# Altium schematic sheet Jukebox Processing.SchDoc: Jukebox CPU and CPLD
size B; DrawnBy: Tim Menninger; Revision: 2.0; SheetNumber: 2; SheetTotal: 5
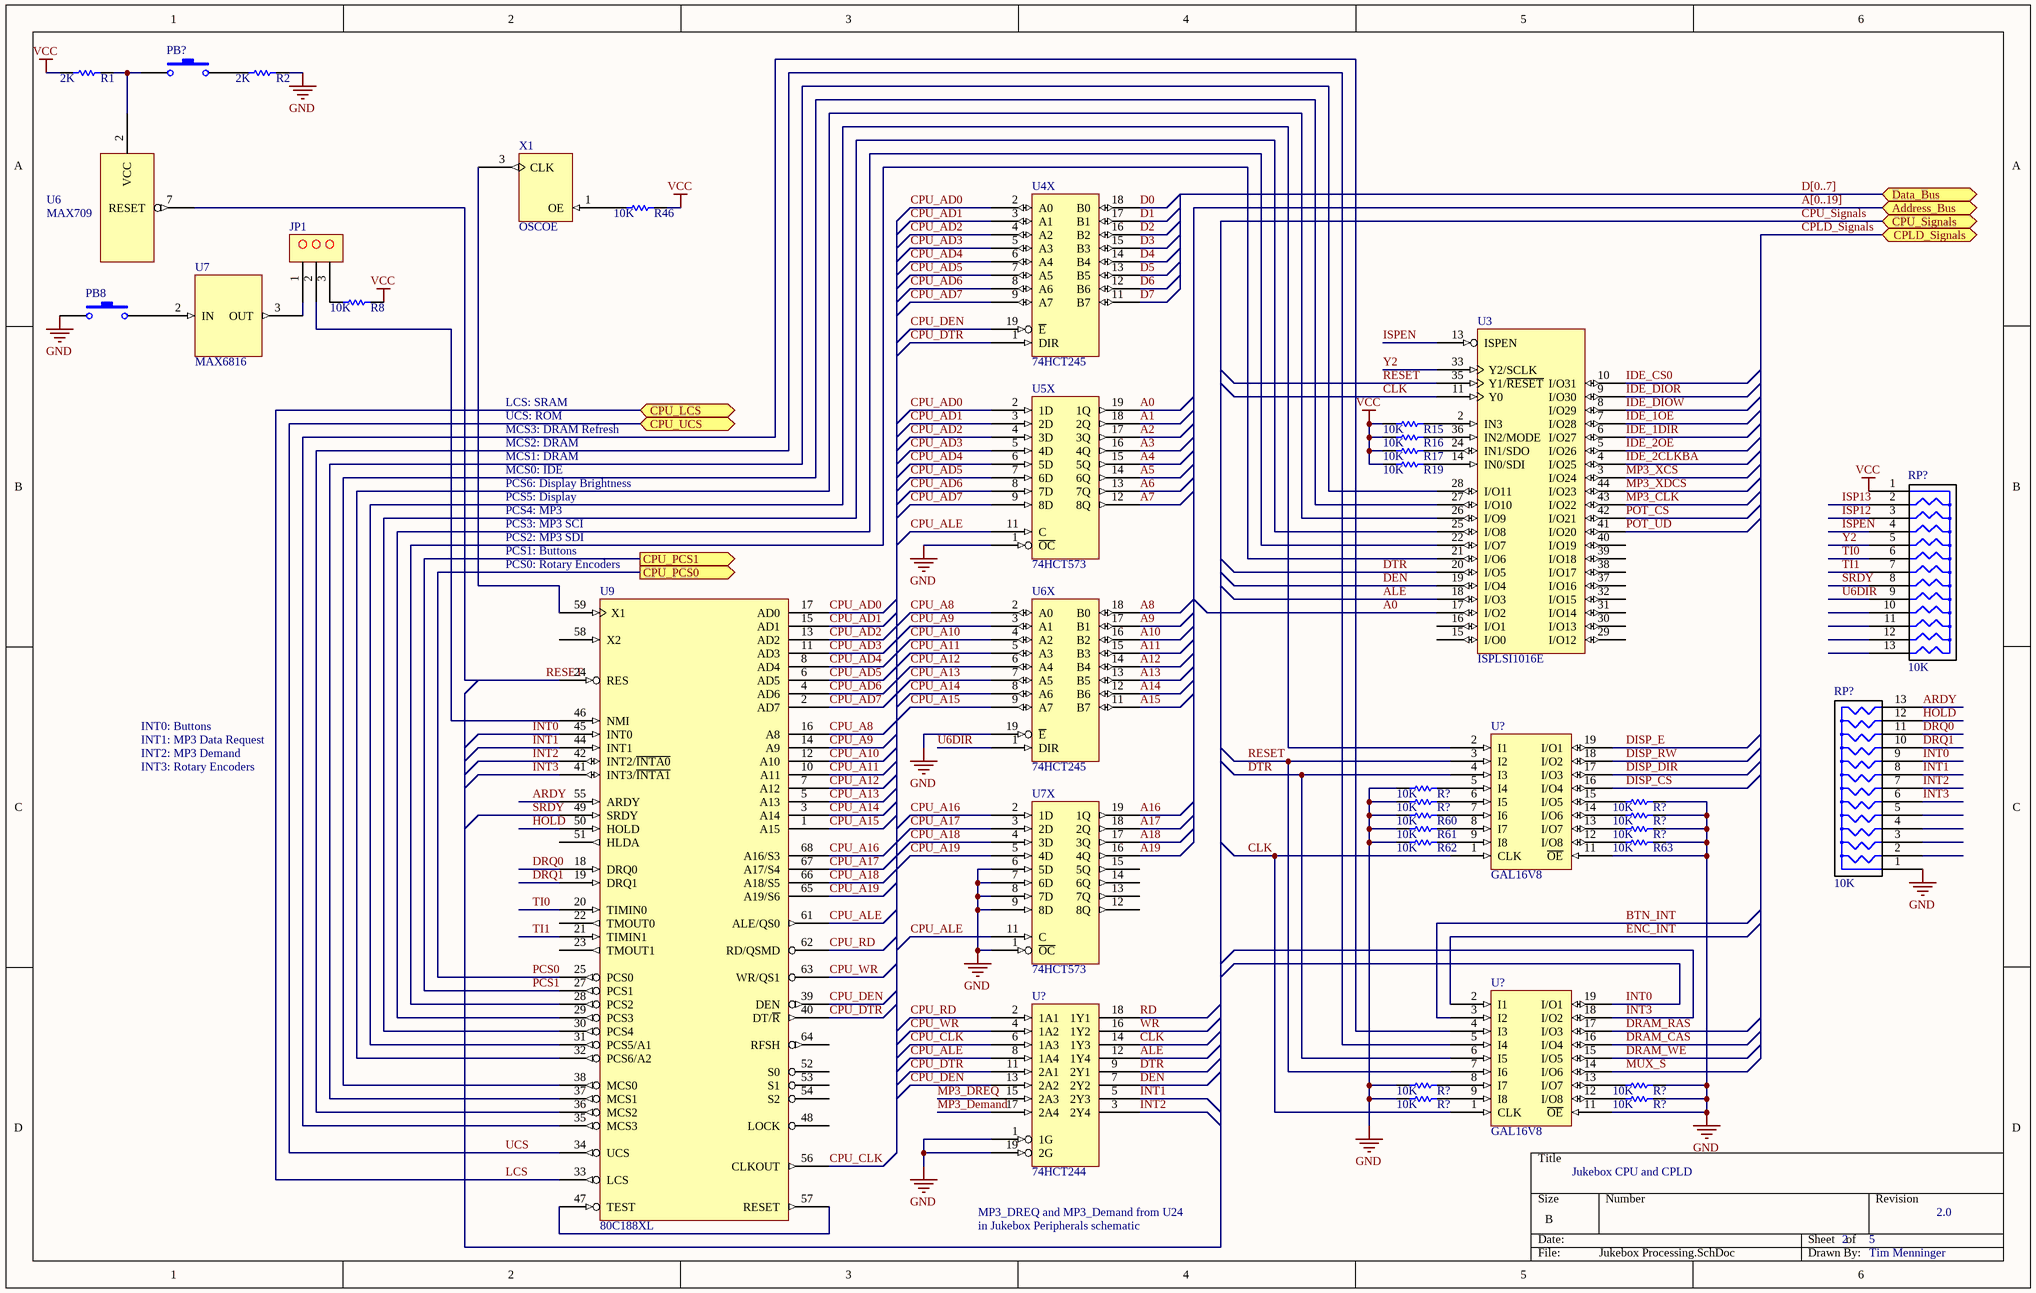
[diagram p0: Jukebox Processing.SchDoc]

## Parts
(Parts that share a designator on the sheet are numbered #1, #2 ... from top to bottom, then left to right.)
JP1  3P_JP  [HDR1X3]  (value not drawn)
PB8  SW-PB  [KSR_PB_NC]  (value not drawn)
PB?  SW-PB  [KSR_PB_NC]  (value not drawn)
R1  value 2K  [6-0805_L]  (hidden comment: Res1)
R2  value 2K  [6-0805_L]  (hidden comment: Res1)
R8  value 10K  [6-0805_L]  (hidden comment: Res1)
R15  value 10K  [6-0805_L]  (hidden comment: Res1)
R16  value 10K  [6-0805_L]  (hidden comment: Res1)
R17  value 10K  [6-0805_L]  (hidden comment: Res1)
R19  value 10K  [6-0805_L]  (hidden comment: Res1)
R46  value 10K  [6-0805_L]  (hidden comment: Res1)
R60  value 10K  [6-0805_L]  (hidden comment: Res1)
R61  value 10K  [6-0805_L]  (hidden comment: Res1)
R62  value 10K  [6-0805_L]  (hidden comment: Res1)
R63  value 10K  [6-0805_L]  (hidden comment: Res1)
R?#1  value 10K  [6-0805_L]  (hidden comment: Res1)
R?#2  value 10K  [6-0805_L]  (hidden comment: Res1)
R?#3  value 10K  [6-0805_L]  (hidden comment: Res1)
R?#4  value 10K  [6-0805_L]  (hidden comment: Res1)
R?#5  value 10K  [6-0805_L]  (hidden comment: Res1)
R?#6  value 10K  [6-0805_L]  (hidden comment: Res1)
R?#7  value 10K  [6-0805_L]  (hidden comment: Res1)
R?#8  value 10K  [6-0805_L]  (hidden comment: Res1)
R?#9  value 10K  [6-0805_L]  (hidden comment: Res1)
RP?#1  10K
RP?#2  10K
U3  ISPLSI1016E  [PLCCS44]
U4X  74HCT245  [DIP20]
U5X  74HCT573  [DIP20]
U6  MAX709  [UMAX8]
U6X  74HCT245  [DIP20]
U7  MAX6816  [SOT-143]
U7X  74HCT573  [DIP20]
U9  80C188XL  [PLCCS68I]
U?#1  GAL16V8
U?#2  74HCT244  [DIP20]
U?#3  GAL16V8
X1  OSCOE  [DIPS8-4]

## Ports
Address_Bus, CPLD_Signals, CPU_LCS, CPU_PCS0 (out), CPU_PCS1 (out), CPU_Signals, CPU_UCS, Data_Bus

## Nets
GND: PB8.1 R2.2 R60.1 R61.1 R62.1 R63.2 R?#1.1 R?#2.1 R?#3.2 R?#4.2 R?#5.2 R?#6.1 R?#7.2 R?#8.1 R?#9.2 RP?#2.1 U3.1(GND) U3.23(GND) U4X.10(GND) U5X.1(~{OC}) U5X.10(GND) U6.3(GND) U6X.10(GND) U6X.19(~{E}) U7.1(GND) U7X.1(~{OC}) U7X.6(5D) U7X.7(6D) U7X.8(7D) U7X.9(8D) U7X.10(GND) U9.26(GND) U9.60(GND) U?#1.10(GND) U?#1.11(~{OE}) U?#2.1(1G) U?#2.10(GND) U?#2.19(2G) U?#3.10(GND) U?#3.11(~{OE}) X1.2(GND)
VCC: R1.1 R8.2 R15.1 R16.1 R17.1 R19.1 R46.2 RP?#1.1 U3.12(VCC) U3.34(VCC) U4X.20(VCC) U5X.20(VCC) U6X.20(VCC) U7.4(VCC) U7X.20(VCC) U9.9(VCC) U9.43(VCC) U?#1.20(VCC) U?#2.20(VCC) U?#3.20(VCC) X1.4(VCC)
A0: U3.17(I/O2) U5X.19(1Q)
A1: U5X.18(2Q)
A2: U5X.17(3Q)
A3: U5X.16(4Q)
A4: U5X.15(5Q)
A5: U5X.14(6Q)
A6: U5X.13(7Q)
A7: U5X.12(8Q)
A8: U6X.18(B0)
A9: U6X.17(B1)
A10: U6X.16(B2)
A11: U6X.15(B3)
A12: U6X.14(B4)
A13: U6X.13(B5)
A14: U6X.12(B6)
A15: U6X.11(B7)
A16: U7X.19(1Q)
A17: U7X.18(2Q)
A18: U7X.17(3Q)
A19: U7X.16(4Q)
ALE: U3.18(I/O3) U?#2.12(1Y4)
ARDY: RP?#2.13 U9.55(ARDY)
BTN_INT: U?#3.3(I2)
CLK: U3.11(Y0) U?#1.1(CLK) U?#2.14(1Y3) U?#3.1(CLK)
CPU_A8: U6X.2(A0) U9.16(A8)
CPU_A9: U6X.3(A1) U9.14(A9)
CPU_A10: U6X.4(A2) U9.12(A10)
CPU_A11: U6X.5(A3) U9.10(A11)
CPU_A12: U6X.6(A4) U9.7(A12)
CPU_A13: U6X.7(A5) U9.5(A13)
CPU_A14: U6X.8(A6) U9.3(A14)
CPU_A15: U6X.9(A7) U9.1(A15)
CPU_A16: U7X.2(1D) U9.68(A16/S3)
CPU_A17: U7X.3(2D) U9.67(A17/S4)
CPU_A18: U7X.4(3D) U9.66(A18/S5)
CPU_A19: U7X.5(4D) U9.65(A19/S6)
CPU_AD0: U4X.2(A0) U5X.2(1D) U9.17(AD0)
CPU_AD1: U4X.3(A1) U5X.3(2D) U9.15(AD1)
CPU_AD2: U4X.4(A2) U5X.4(3D) U9.13(AD2)
CPU_AD3: U4X.5(A3) U5X.5(4D) U9.11(AD3)
CPU_AD4: U4X.6(A4) U5X.6(5D) U9.8(AD4)
CPU_AD5: U4X.7(A5) U5X.7(6D) U9.6(AD5)
CPU_AD6: U4X.8(A6) U5X.8(7D) U9.4(AD6)
CPU_AD7: U4X.9(A7) U5X.9(8D) U9.2(AD7)
CPU_ALE: U5X.11(C) U7X.11(C) U9.61(ALE/QS0) U?#2.8(1A4)
CPU_CLK: U9.56(CLKOUT) U?#2.6(1A3)
CPU_DEN: U4X.19(~{E}) U9.39(DEN) U?#2.13(2A2)
CPU_DTR: U4X.1(DIR) U9.40(DT/~{R}) U?#2.11(2A1)
CPU_RD: U9.62(RD/QSMD) U?#2.2(1A1)
CPU_WR: U9.63(WR/QS1) U?#2.4(1A2)
D0: U4X.18(B0)
D1: U4X.17(B1)
D2: U4X.16(B2)
D3: U4X.15(B3)
D4: U4X.14(B4)
D5: U4X.13(B5)
D6: U4X.12(B6)
D7: U4X.11(B7)
DEN: U3.19(I/O4) U?#2.7(2Y2)
DISP_CS: U?#1.16(I/O4)
DISP_DIR: U?#1.17(I/O3)
DISP_E: U?#1.19(I/O1)
DISP_RW: U?#1.18(I/O2)
DRAM_CAS: U?#3.16(I/O4)
DRAM_RAS: U?#3.17(I/O3)
DRAM_WE: U?#3.15(I/O5)
DRQ0: RP?#2.11 U9.18(DRQ0)
DRQ1: RP?#2.10 U9.19(DRQ1)
DTR: U3.20(I/O5) U?#1.4(I3) U?#2.9(2Y1) U?#3.6(I5)
ENC_INT: U?#3.2(I1)
HOLD: RP?#2.12 U9.50(HOLD)
IDE_1DIR: U3.6(I/O27)
IDE_1OE: U3.7(I/O28)
IDE_2CLKBA: U3.4(I/O25)
IDE_2OE: U3.5(I/O26)
IDE_CS0: U3.10(I/O31)
IDE_DIOR: U3.9(I/O30)
IDE_DIOW: U3.8(I/O29)
INT0: RP?#2.9 U9.45(INT0) U?#3.19(I/O1)
INT1: RP?#2.8 U9.44(INT1) U?#2.5(2Y3)
INT2: RP?#2.7 U9.42(INT2/~{INTA0}) U?#2.3(2Y4)
INT3: RP?#2.6 U9.41(INT3/~{INTA1}) U?#3.18(I/O2)
ISP12: RP?#1.3
ISP13: RP?#1.2
ISPEN: RP?#1.4 U3.13(ISPEN)
LCS: U9.33(LCS) ; port CPU_LCS
MP3_CLK: U3.43(I/O22)
MP3_Demand: U?#2.17(2A4)
MP3_DREQ: U?#2.15(2A3)
MP3_XCS: U3.3(I/O24)
MP3_XDCS: U3.44(I/O23)
MUX_S: U?#3.14(I/O6)
PCS0: U9.25(PCS0) ; port CPU_PCS0
PCS1: U9.27(PCS1) ; port CPU_PCS1
POT_CS: U3.42(I/O21)
POT_UD: U3.41(I/O20)
RD: U?#2.18(1Y1)
RESET: U3.35(Y1/~{RESET}) U6.7(RESET) U9.24(RES) U?#1.3(I2) U?#3.7(I6)
SRDY: RP?#1.8 U9.49(SRDY)
TI0: RP?#1.6 U9.20(TIMIN0)
TI1: RP?#1.7 U9.21(TIMIN1)
U6DIR: RP?#1.9 U6X.1(DIR)
UCS: U9.34(UCS) ; port CPU_UCS
WR: U?#2.16(1Y2)
Y2: RP?#1.5 U3.33(Y2/SCLK)
NetJP1_1: JP1.1 U7.3(OUT)
NetJP1_2: JP1.2 U9.46(NMI)
NetJP1_3: JP1.3 R8.1
NetPB8_2: PB8.2 U7.2(IN)
NetPB?_1: PB?.1 R1.2 U6.2(VCC)
NetPB?_2: PB?.2 R2.1
NetR15_2: R15.2 U3.2(IN3)
NetR16_2: R16.2 U3.36(IN2/MODE)
NetR17_2: R17.2 U3.24(IN1/SDO)
NetR19_2: R19.2 U3.14(IN0/SDI)
NetR46_1: R46.1 X1.1(OE)
NetR60_2: R60.2 U?#1.7(I6)
NetR61_2: R61.2 U?#1.8(I7)
NetR62_2: R62.2 U?#1.9(I8)
NetR63_1: R63.1 U?#1.12(I/O8)
NetR?#1_2: R?#1.2 U?#1.5(I4)
NetR?#2_2: R?#2.2 U?#1.6(I5)
NetR?#3_1: R?#3.1 U?#1.15(I/O5)
NetR?#4_1: R?#4.1 U?#1.14(I/O6)
NetR?#5_1: R?#5.1 U?#1.13(I/O7)
NetR?#6_2: R?#6.2 U?#3.8(I7)
NetR?#7_1: R?#7.1 U?#3.13(I/O7)
NetR?#8_2: R?#8.2 U?#3.9(I8)
NetR?#9_1: R?#9.1 U?#3.12(I/O8)
NetU3_21: U3.21(I/O6) U9.28(PCS2)
NetU3_22: U3.22(I/O7) U9.29(PCS3)
NetU3_25: U3.25(I/O8) U9.30(PCS4)
NetU3_26: U3.26(I/O9) U9.32(PCS6/A2)
NetU3_27: U3.27(I/O10) U9.38(MCS0)
NetU3_28: U3.28(I/O11) U9.37(MCS1)
NetU9_31: U9.31(PCS5/A1) U?#1.2(I1)
NetU9_35: U9.35(MCS3) U?#3.4(I3)
NetU9_36: U9.36(MCS2) U?#3.5(I4)
NetU9_47: U9.47(TEST) U9.57(RESET)
NetU9_59: U9.59(X1) X1.3(CLK)

Not connected (* = marked no-connect by the designer): RP?#1 10 11 12 13; RP?#2 2 3 4 5; U3 15(I/O0) 16(I/O1) 29(I/O12) 30(I/O13) 31(I/O14) 32(I/O15) 37(I/O16) 38(I/O17) 39(I/O18) 40(I/O19); U7X 12(8Q) 13(7Q) 14(6Q) 15(5Q); U9 22(TMOUT0) 23(TMOUT1) 48(LOCK) 51(HLDA) 52(S0) 53(S1) 54(S2) 58(X2) 64(RFSH)

## Buses and harness runs
bus A[0..19] = port Address_Bus
bus CPLD_Signals = port CPLD_Signals
bus CPU_Signals = port CPU_Signals
bus D[0..7] = port Data_Bus

## Notes on the sheet
- MCS3: DRAM Refresh
- UCS: ROM
- LCS: SRAM
- PCS6: Display Brightness
- PCS5: Display
- MCS0: IDE
- MCS2: DRAM
- MCS1: DRAM
- PCS1: Buttons
- (near U9) PCS0: Rotary Encoders
- PCS2: MP3 SDI
- PCS4: MP3
- PCS3: MP3 SCI
- INT0: Buttons
- INT1: MP3 Data Request
- INT2: MP3 Demand
- INT3: Rotary Encoders
- MP3_DREQ and MP3_Demand from U24
- in Jukebox Peripherals schematic

## Library data of the parts
PB8 PB? = SW-PB: Switch; Published: 24-Mar-1999; LatestRevisionDate: 17-Jul-2002; LatestRevisionNote: Re-released for DXP Platform.; PackageReference: SPST-2; Publisher: Altium Limited; PackageDescription: Switch; 2 Leads
R1 R2 R8 R15-R17 R19 R46 R60-R63 R?#1-R?#9 = Res1: Resistor; Published: 8-Jun-2000; LatestRevisionDate: 17-Jul-2002; LatestRevisionNote: Re-released for DXP Platform.; PackageReference: AXIAL-0.3; Publisher: Altium Limited; PackageDescription: Axial Device, Thru-Hole; 2 Leads; 0.3 in Pin Spacing
RP?#1 RP?#2 = RPACK12
U3 = ISPLSI1016: In-System Programmable High Density CPLD
U4X U6X = 74HCT245: Octal Bus Transceiver
U5X U7X = 74HCT573: Octal Transparent Latch
U6 = MAX709: Maxim Power-On Reset
U7 = MAX6816: Single Switch Debouncer
U9 = 80C188XL: Intel 80188 Microprocessor
U?#2 = 74HCT244: Octal Buffer
X1 = OSCOE: Oscillator with Active High Output Enable